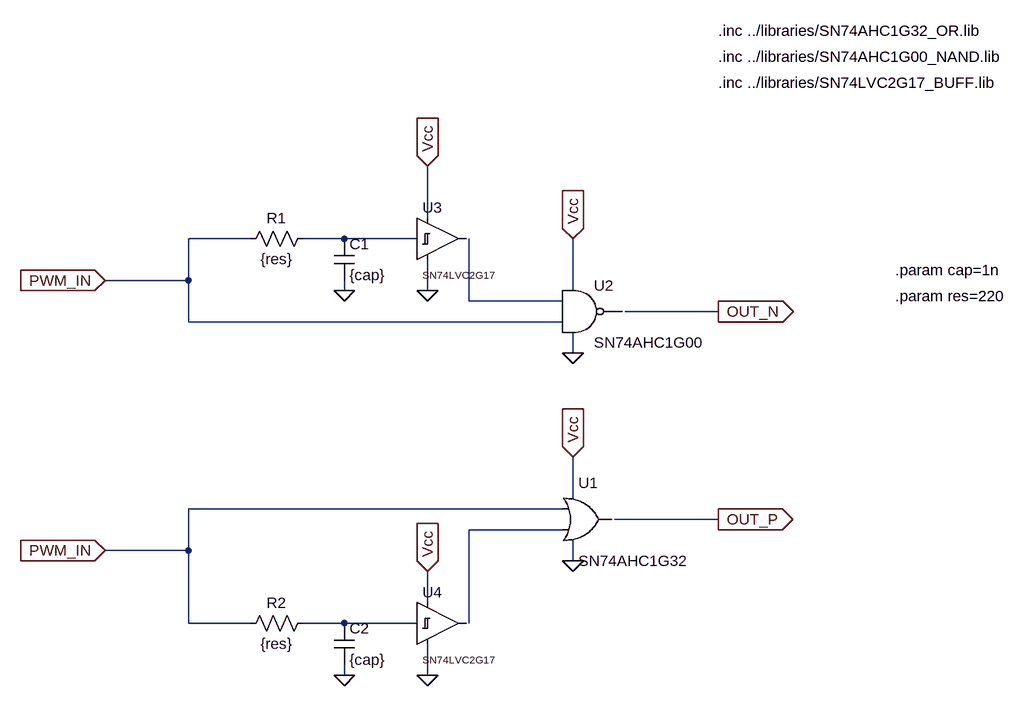
[diagram p0: schematic Deadtime_component.asc]
Deadtime_component.asc, the LTspice schematic file:
Version 4
SHEET 1 1604 680
WIRE -96 -48 -96 -128
WIRE -368 -16 -464 -16
WIRE -224 -16 -288 -16
WIRE -112 -16 -224 -16
WIRE -464 48 -464 -16
WIRE -464 48 -592 48
WIRE -224 64 -224 48
WIRE -96 64 -96 16
WIRE 128 64 128 -16
WIRE -32 80 -32 -16
WIRE 112 80 -32 80
WIRE 352 96 208 96
WIRE -464 112 -464 48
WIRE 112 112 -464 112
WIRE 128 160 128 128
WIRE 128 384 128 320
WIRE 112 400 -464 400
WIRE 352 416 192 416
WIRE 112 432 -32 432
WIRE -464 464 -464 400
WIRE -464 464 -592 464
WIRE 128 480 128 448
WIRE -96 544 -96 496
WIRE -464 576 -464 464
WIRE -368 576 -464 576
WIRE -224 576 -288 576
WIRE -112 576 -224 576
WIRE -32 576 -32 432
WIRE -224 656 -224 640
WIRE -96 656 -96 608
FLAG 128 160 0
FLAG 128 480 0
FLAG 128 -16 Vcc
IOPIN 128 -16 In
FLAG 128 320 Vcc
IOPIN 128 320 In
FLAG -96 656 0
FLAG -96 64 0
FLAG -96 496 Vcc
IOPIN -96 496 In
FLAG -96 -128 Vcc
IOPIN -96 -128 In
FLAG -224 64 0
FLAG -224 656 0
FLAG 352 416 OUT_P
IOPIN 352 416 Out
FLAG 352 96 OUT_N
IOPIN 352 96 Out
FLAG -592 48 PWM_IN
IOPIN -592 48 In
FLAG -592 464 PWM_IN
IOPIN -592 464 In
SYMBOL schmitt_buffer -112 -80 R0
WINDOW 3 8 120 Left 1
SYMATTR InstName U3
SYMBOL schmitt_buffer -112 512 R0
WINDOW 3 8 120 Left 1
SYMATTR InstName U4
SYMBOL res -272 -32 R90
WINDOW 0 0 56 VBottom 2
WINDOW 3 32 56 VTop 2
SYMATTR InstName R1
SYMATTR Value {res}
SYMBOL cap -240 -16 R0
SYMATTR InstName C1
SYMATTR Value {cap}
SYMBOL res -272 560 R90
WINDOW 0 0 56 VBottom 2
WINDOW 3 32 56 VTop 2
SYMATTR InstName R2
SYMATTR Value {res}
SYMBOL cap -240 576 R0
SYMATTR InstName C2
SYMATTR Value {cap}
SYMBOL my_or 144 352 R0
SYMATTR InstName U1
SYMBOL my_nand 144 32 R0
SYMATTR InstName U2
TEXT 352 -336 Left 2 !.inc ../libraries/SN74AHC1G32_OR.lib
TEXT 352 -296 Left 2 !.inc ../libraries/SN74AHC1G00_NAND.lib
TEXT 352 -256 Left 2 !.inc ../libraries/SN74LVC2G17_BUFF.lib
TEXT 624 32 Left 2 !.param cap=1n
TEXT 624 72 Left 2 !.param res=220

The netlist it stands for:
* Deadtime_component.asc
XU3 N002 N001 Vcc 0 SN74LVC2G17  ; pins Y A VCC AGND
XU4 N003 N004 Vcc 0 SN74LVC2G17  ; pins Y A VCC AGND
R1 N001 PWM_IN {res}
C1 N001 0 {cap}
R2 N004 PWM_IN {res}
C2 N004 0 {cap}
XU1 OUT_P PWM_IN N003 Vcc 0 SN74AHC1G32  ; pins Y A B VCC AGND
XU2 OUT_N N002 PWM_IN Vcc 0 SN74AHC1G00  ; pins Y A B VCC AGND
.inc ../libraries/SN74AHC1G32_OR.lib
.inc ../libraries/SN74AHC1G00_NAND.lib
.inc ../libraries/SN74LVC2G17_BUFF.lib
.param cap=1n
.param res=220
.backanno
.end